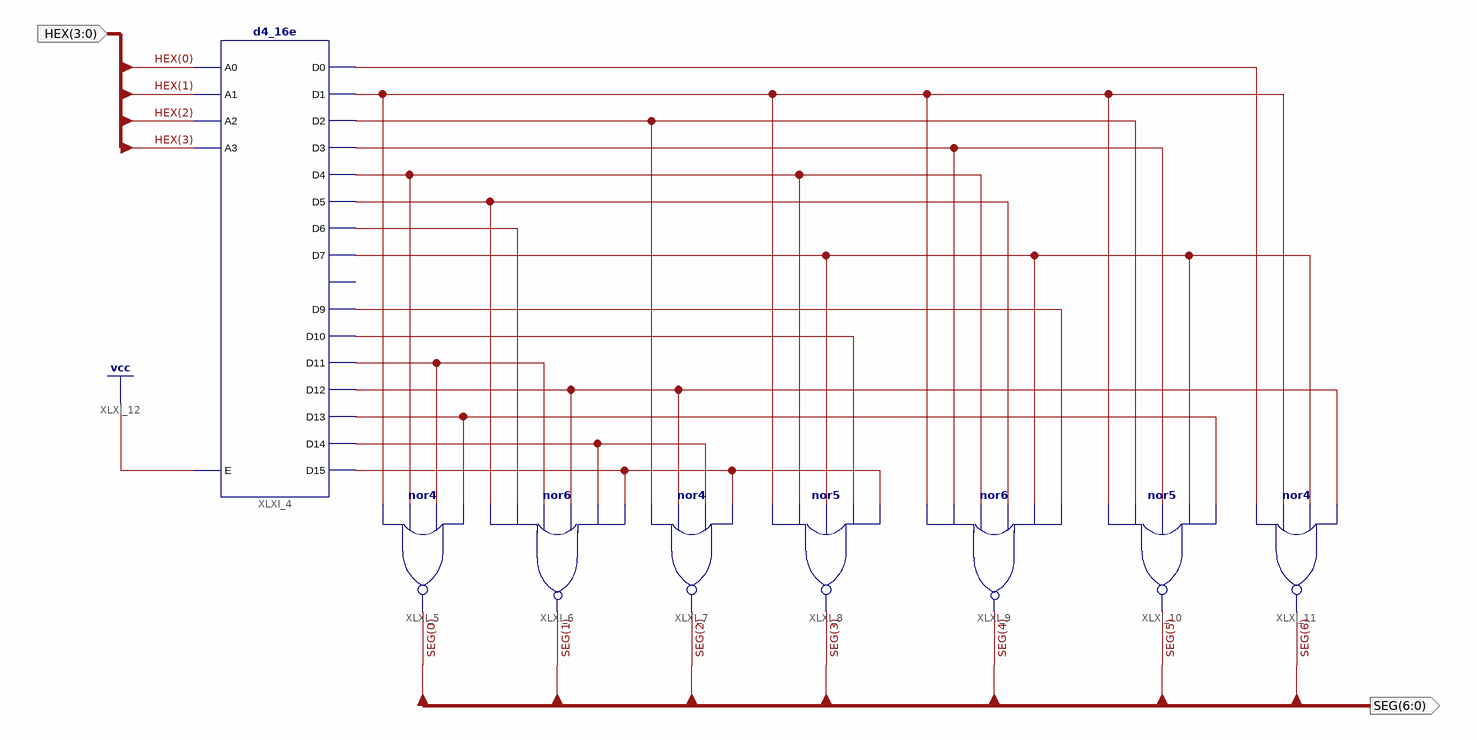
[diagram p0: schematic sheet 1]
// Xilinx ISE schematic HEXto7Seg.sch (spartan6) as structural Verilog: 8 symbols, 2 ports
module HEXto7Seg (
  input  [3:0] HEX,
  output [6:0] SEG
);

  wire XLXN_1, XLXN_2, XLXN_3, XLXN_4, XLXN_5, XLXN_6, XLXN_7, XLXN_8, XLXN_10, XLXN_11, XLXN_12, XLXN_13,
       XLXN_14, XLXN_15, XLXN_16;

  d4_16e XLXI_4 (
    .A0(HEX[0]), .A1(HEX[1]), .A2(HEX[2]), .A3(HEX[3]), .E(1'b1), .D0(XLXN_1), .D1(XLXN_2), .D10(XLXN_11),
    .D11(XLXN_12), .D12(XLXN_13), .D13(XLXN_14), .D14(XLXN_15), .D15(XLXN_16), .D2(XLXN_3), .D3(XLXN_4),
    .D4(XLXN_5), .D5(XLXN_6), .D6(XLXN_7), .D7(XLXN_8), .D9(XLXN_10));  // open: D8
  nor XLXI_5 (SEG[0], XLXN_2, XLXN_5, XLXN_12, XLXN_14);
  nor XLXI_6 (SEG[1], XLXN_6, XLXN_7, XLXN_12, XLXN_13, XLXN_15, XLXN_16);
  nor XLXI_7 (SEG[2], XLXN_3, XLXN_13, XLXN_15, XLXN_16);
  nor XLXI_8 (SEG[3], XLXN_2, XLXN_5, XLXN_8, XLXN_11, XLXN_16);
  nor XLXI_9 (SEG[4], XLXN_2, XLXN_4, XLXN_5, XLXN_6, XLXN_8, XLXN_10);
  nor XLXI_10 (SEG[5], XLXN_2, XLXN_3, XLXN_4, XLXN_8, XLXN_14);
  nor XLXI_11 (SEG[6], XLXN_1, XLXN_2, XLXN_8, XLXN_13);
endmodule
